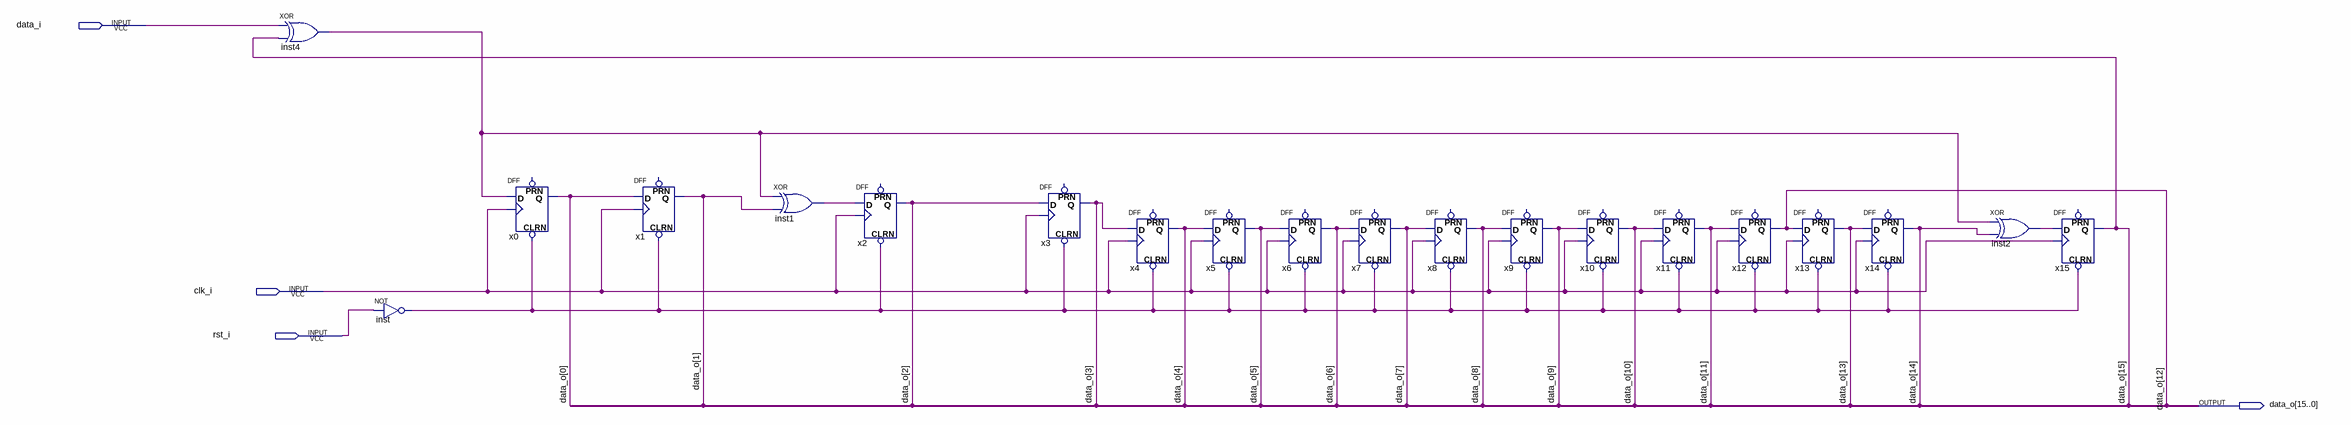
[diagram p0: schematic sheet]
// Quartus schematic crc_16_ansi.bdf as structural Verilog: 20 symbols, 4 pins
module crc_16_ansi (
  input  data_i,
  input  clk_i,
  input  rst_i,
  output [15:0] data_o
);

  wire inst1_out, inst2_out, inst4_out, inst_out;

  xor inst4 (inst4_out, data_i, data_o[15]);
  not inst (inst_out, rst_i);
  DFF x0 (.CLRN(inst_out), .CLK(clk_i), .D(inst4_out), .Q(data_o[0]));  // open: PRN
  DFF x1 (.CLRN(inst_out), .CLK(clk_i), .D(data_o[0]), .Q(data_o[1]));  // open: PRN
  xor inst1 (inst1_out, inst4_out, data_o[1]);
  DFF x2 (.CLRN(inst_out), .CLK(clk_i), .D(inst1_out), .Q(data_o[2]));  // open: PRN
  DFF x3 (.CLRN(inst_out), .CLK(clk_i), .D(data_o[2]), .Q(data_o[3]));  // open: PRN
  DFF x4 (.CLRN(inst_out), .CLK(clk_i), .D(data_o[3]), .Q(data_o[4]));  // open: PRN
  DFF x5 (.CLRN(inst_out), .CLK(clk_i), .D(data_o[4]), .Q(data_o[5]));  // open: PRN
  DFF x6 (.CLRN(inst_out), .CLK(clk_i), .D(data_o[5]), .Q(data_o[6]));  // open: PRN
  DFF x7 (.CLRN(inst_out), .CLK(clk_i), .D(data_o[6]), .Q(data_o[7]));  // open: PRN
  DFF x8 (.CLRN(inst_out), .CLK(clk_i), .D(data_o[7]), .Q(data_o[8]));  // open: PRN
  DFF x9 (.CLRN(inst_out), .CLK(clk_i), .D(data_o[8]), .Q(data_o[9]));  // open: PRN
  DFF x10 (.CLRN(inst_out), .CLK(clk_i), .D(data_o[9]), .Q(data_o[10]));  // open: PRN
  DFF x11 (.CLRN(inst_out), .CLK(clk_i), .D(data_o[10]), .Q(data_o[11]));  // open: PRN
  DFF x12 (.CLRN(inst_out), .CLK(clk_i), .D(data_o[11]), .Q(data_o[12]));  // open: PRN
  DFF x13 (.CLRN(inst_out), .CLK(clk_i), .D(data_o[12]), .Q(data_o[13]));  // open: PRN
  DFF x14 (.CLRN(inst_out), .CLK(clk_i), .D(data_o[13]), .Q(data_o[14]));  // open: PRN
  xor inst2 (inst2_out, inst4_out, data_o[14]);
  DFF x15 (.CLRN(inst_out), .CLK(clk_i), .D(inst2_out), .Q(data_o[15]));  // open: PRN
endmodule
